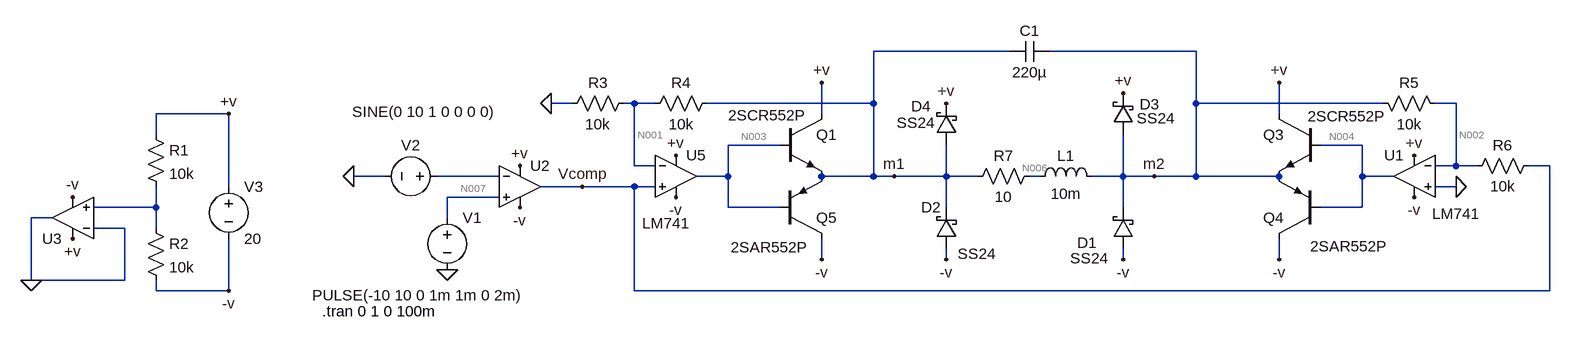
[diagram p0: schematic Driver_motor.asc]
Driver_motor.asc, the LTspice schematic file:
Version 4
SHEET 1 1204 680
WIRE 368 -112 160 -112
WIRE 656 -112 432 -112
WIRE -304 -32 -336 -32
WIRE -208 -32 -224 -32
WIRE -176 -32 -208 -32
WIRE 160 -32 160 -112
WIRE 160 -32 -96 -32
WIRE 656 -32 656 -112
WIRE 944 -32 656 -32
WIRE 1056 -32 1024 -32
WIRE -832 -16 -944 -16
WIRE 80 -16 80 -64
WIRE 784 -16 784 -64
WIRE -944 16 -944 -16
WIRE 16 32 -64 32
WIRE 912 32 848 32
WIRE -208 64 -208 -32
WIRE -176 64 -208 64
WIRE 1056 64 1056 -32
WIRE 1056 64 1024 64
WIRE 1088 64 1056 64
WIRE 1200 64 1168 64
WIRE -592 80 -640 80
WIRE -416 80 -512 80
WIRE -64 80 -64 32
WIRE -64 80 -112 80
WIRE 160 80 160 -32
WIRE 160 80 80 80
WIRE 192 80 160 80
WIRE 272 80 272 32
WIRE 272 80 192 80
WIRE 320 80 272 80
WIRE 416 80 400 80
WIRE 544 80 544 16
WIRE 544 80 496 80
WIRE 592 80 544 80
WIRE 656 80 656 -32
WIRE 656 80 592 80
WIRE 784 80 656 80
WIRE 912 80 912 32
WIRE 960 80 912 80
WIRE -832 96 -832 -16
WIRE -288 96 -352 96
WIRE -208 96 -288 96
WIRE -176 96 -208 96
WIRE 1056 96 1024 96
WIRE -416 112 -496 112
WIRE -944 128 -944 96
WIRE -944 128 -1040 128
WIRE -64 128 -64 80
WIRE 16 128 -64 128
WIRE 272 128 272 80
WIRE 544 128 544 80
WIRE 912 128 912 80
WIRE 912 128 848 128
WIRE -1104 144 -1136 144
WIRE -496 144 -496 112
WIRE -992 160 -1040 160
WIRE -944 160 -944 128
WIRE 80 208 80 176
WIRE 272 208 272 192
WIRE 544 208 544 192
WIRE 784 208 784 176
WIRE -1136 240 -1136 144
WIRE -992 240 -992 160
WIRE -992 240 -1136 240
WIRE -944 256 -944 240
WIRE -832 256 -832 176
WIRE -832 256 -944 256
WIRE -208 256 -208 96
WIRE 1200 256 1200 64
WIRE 1200 256 -208 256
FLAG -496 224 0
FLAG -640 80 0
FLAG -832 -16 +v
FLAG -832 256 -v
FLAG -384 64 +v
FLAG -384 128 -v
FLAG -1072 176 +v
FLAG -1072 112 -v
FLAG -1136 240 0
FLAG -288 96 Vcomp
FLAG -336 -32 0
FLAG -144 112 -v
FLAG -144 48 +v
FLAG 80 208 -v
FLAG 80 -64 +v
FLAG 992 112 -v
FLAG 992 48 +v
FLAG 784 208 -v
FLAG 784 -64 +v
FLAG 1056 96 0
FLAG 192 80 m1
FLAG 592 80 m2
FLAG 544 -48 +v
FLAG 272 -32 +v
FLAG 272 208 -v
FLAG 544 208 -v
SYMBOL voltage -496 128 R0
WINDOW 3 -208 135 Left 2
WINDOW 123 0 0 Left 0
WINDOW 39 0 0 Left 0
SYMATTR InstName V1
SYMATTR Value PULSE(-10 10 0 1m 1m 0 2m)
SYMBOL voltage -496 80 R90
WINDOW 0 -32 56 VBottom 2
WINDOW 3 -115 36 VTop 2
WINDOW 123 0 0 Left 0
WINDOW 39 0 0 Left 0
SYMATTR InstName V2
SYMATTR Value SINE(0 10 1 0 0 0 0)
SYMBOL voltage -832 80 R0
WINDOW 123 0 0 Left 0
WINDOW 39 0 0 Left 0
SYMATTR InstName V3
SYMATTR Value 20
SYMBOL res -960 0 R0
SYMATTR InstName R1
SYMATTR Value 10k
SYMBOL res -960 144 R0
SYMATTR InstName R2
SYMATTR Value 10k
SYMBOL res -208 -48 R90
WINDOW 0 0 56 VBottom 2
WINDOW 3 32 56 VTop 2
SYMATTR InstName R3
SYMATTR Value 10k
SYMBOL res -80 -48 R90
WINDOW 0 0 56 VBottom 2
WINDOW 3 32 56 VTop 2
SYMATTR InstName R4
SYMATTR Value 10k
SYMBOL npn 16 -16 R0
WINDOW 3 -80 2 Left 2
SYMATTR InstName Q1
SYMATTR Value 2SCR552P
SYMBOL res 928 -48 M90
WINDOW 0 0 56 VBottom 2
WINDOW 3 32 56 VTop 2
SYMATTR InstName R5
SYMATTR Value 10k
SYMBOL pnp 848 176 R180
WINDOW 3 -102 -12 Left 2
SYMATTR InstName Q4
SYMATTR Value 2SAR552P
SYMBOL res 1072 80 R270
WINDOW 0 32 56 VTop 2
WINDOW 3 0 56 VBottom 2
SYMATTR InstName R6
SYMATTR Value 10k
SYMBOL res 416 64 R90
WINDOW 0 0 56 VBottom 2
WINDOW 3 32 56 VTop 2
SYMATTR InstName R7
SYMATTR Value 10
SYMBOL npn 848 -16 M0
WINDOW 3 -100 4 Left 2
SYMATTR InstName Q3
SYMATTR Value 2SCR552P
SYMBOL pnp 16 176 M180
WINDOW 3 -76 -13 Left 2
SYMATTR InstName Q5
SYMATTR Value 2SAR552P
SYMBOL ind 400 96 R270
WINDOW 0 32 56 VTop 2
WINDOW 3 5 56 VBottom 2
SYMATTR InstName L1
SYMATTR Value 10m
SYMBOL schottky 288 192 R180
WINDOW 0 24 64 Left 2
WINDOW 3 -60 -7 Left 2
SYMATTR InstName D2
SYMATTR Value SS24
SYMATTR Description Diode
SYMATTR Type diode
SYMBOL schottky 560 192 R180
WINDOW 0 56 10 Left 2
WINDOW 3 39 -14 Left 2
SYMATTR InstName D1
SYMATTR Value SS24
SYMATTR Description Diode
SYMATTR Type diode
SYMBOL schottky 560 16 R180
WINDOW 0 -40 47 Left 2
WINDOW 3 -63 25 Left 2
SYMATTR InstName D3
SYMATTR Value SS24
SYMATTR Description Diode
SYMATTR Type diode
SYMBOL schottky 288 32 R180
WINDOW 0 39 60 Left 2
WINDOW 3 34 34 Left 2
SYMATTR InstName D4
SYMATTR Value SS24
SYMATTR Description Diode
SYMATTR Type diode
SYMBOL cap 432 -128 R90
WINDOW 0 0 32 VBottom 2
WINDOW 3 32 32 VTop 2
SYMATTR InstName C1
SYMATTR Value 220µ
SYMBOL LM741 -144 16 R0
WINDOW 3 -52 136 Left 2
SYMATTR InstName U5
SYMBOL LM741 992 16 M0
WINDOW 3 -102 122 Left 2
SYMATTR InstName U1
SYMBOL OpAmps\\UniversalOpAmp2 -384 96 R0
SYMATTR InstName U2
SYMBOL OpAmps\\UniversalOpAmp2 -1072 144 R180
SYMATTR InstName U3
TEXT -688 288 Left 2 !.tran 0 1 0 100m

The netlist it stands for:
* Driver_motor.asc
V1 N007 0 PULSE(-10 10 0 1m 1m 0 2m)
V2 N005 0 SINE(0 10 1 0 0 0 0)
V3 +v -v 20
R1 +v N008 10k
R2 N008 -v 10k
R3 N001 0 10k
R4 m1 N001 10k
Q1 +v N003 m1 0 2SCR552P
R5 m2 N002 10k
Q4 -v N004 m2 0 2SAR552P
R6 N002 Vcomp 10k
R7 N006 m1 10
Q3 +v N004 m2 0 2SCR552P
Q5 -v N003 m1 0 2SAR552P
L1 N006 m2 10m
D2 -v m1 SS24
D1 -v m2 SS24
D3 m2 +v SS24
D4 m1 +v SS24
C1 m2 m1 220µ
XU5 Vcomp N001 +v -v N003 LM741  ; pins In+ In- V+ V- OUT
XU1 0 N002 +v -v N004 LM741  ; pins In+ In- V+ V- OUT
XU2 N007 N005 +v -v Vcomp level2 Avol=1Meg GBW=10Meg Slew=10Meg Ilimit=25m Rail=0 Vos=0 En=0 Enk=0 In=0 Ink=0 Rin=500Meg  ; pins In+ In- V+ V- OUT
XU3 N008 0 +v -v 0 level2 Avol=1Meg GBW=10Meg Slew=10Meg Ilimit=25m Rail=0 Vos=0 En=0 Enk=0 In=0 Ink=0 Rin=500Meg  ; pins In+ In- V+ V- OUT
.model D D
.lib standard.dio
.model NPN NPN
.model PNP PNP
.lib standard.bjt
.tran 0 1 0 100m
.lib LM741.lib
.lib UniversalOpAmp2.lib
.backanno
.end

* Results of the author's LTspice run, read from the files saved beside the schematic
* Operating Point, zero values left out:
*   V(n007) = -10 V
*   V(+v) = 10 V
*   V(-v) = -10 V
*   V(n001) = -3.997 V
*   V(m1) = -7.873 V
*   V(n003) = -8.692 V
*   V(m2) = 7.945 V
*   V(n002) = -1.013 V
*   V(n004) = 8.76 V
*   V(vcomp) = -9.991 V
*   V(n006) = 7.943 V
*   Ic(Q1) = 19.08 pA
*   Ib(Q1) = -20.28 pA
*   Ie(Q1) = 1.155 pA
*   Ic(Q3) = 1.576 A
*   Ib(Q3) = 6.2 mA
*   Ie(Q3) = -1.582 A
*   Ic(Q4) = -19.7 pA
*   Ib(Q4) = 21.05 pA
*   Ie(Q4) = -1.345 pA
*   Ic(Q5) = -1.573 A
*   Ib(Q5) = -8.604 mA
*   Ie(Q5) = 1.582 A
*   I(D2) = -400 µA
*   I(D1) = -400 µA
*   I(D3) = -400 µA
*   I(D4) = -400 µA
*   I(L1) = -1.582 A
*   I(R1) = 1 mA
*   I(R2) = 1 mA
*   I(R3) = -399.7 µA
*   I(R4) = -387.5 µA
*   I(R5) = 895.8 µA
*   I(R6) = 897.8 µA
*   I(R7) = 1.582 A
*   I(V1) = 20 nA
*   I(V3) = -1.588 A